# Altium schematic sheet Питание.SchDoc
size 209 x 297 mm; Scale: 1:1; DocumentType: Схема электрическая принципиальная; FirstReferrence: АБВГ.123456.001
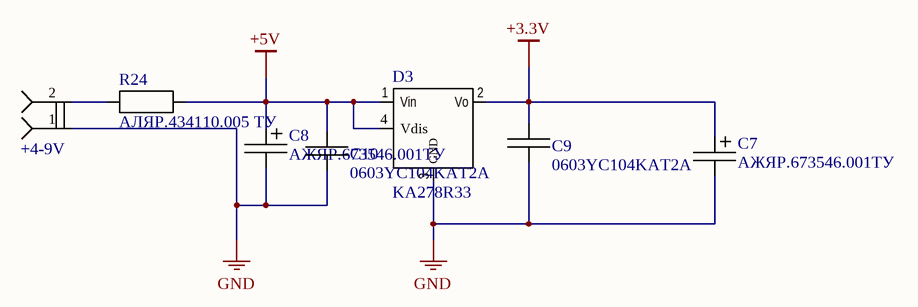
[diagram p0: Питание.SchDoc]

## Parts
+4-9V  (no value)  [284392-2_TE]
C7  АЖЯР.673546.001ТУ  [К53-56_ТИП5]
C8  АЖЯР.673546.001ТУ  [К53-56_ТИП5]
C9  0603YC104KAT2A  [0603-AVX]
C10  0603YC104KAT2A  [0603-AVX]
D3  KA278R33  [TO220-F-4L]
R24  АЛЯР.434110.005 ТУ  [Р1-12-0,25]

## Nets
+3.3V: C7.1 C9.2 D3.2(Vo)
+5V: C8.1 C10.2 D3.1(Vin) D3.4(Vdis) R24.2
GND: +4-9V.1 C7.2 C8.2 C9.1 C10.1 D3.3(GND)
Net+4-9V_2: +4-9V.2 R24.1

## Notes on the sheet
- Перв. примен.
- Справ. №
- Подп. и дата
- Инв. № дубл.
- Взам. инв. №
- Разраб.
- Изм.
- Лист
- № докум.
- Подп.
- Дата
- Лит.
- Масса
- Масштаб
- Пров.
- Т.контр.
- Листов
- Инв. № подл.
- Утв.
- Н.контр.
- 2.106-A4
- Копировал
- Формат А4

## Library data of the parts
+4-9V = Клемник 3.81х2 TE: Manufacturer: Tyco Electronics; ManufacturerPartNumber: 284392-2; Category: Соединитель
C7 C8 = ОСМ К53-56А-16В-100: ManufacturerPartNumber: ОСМ К53-56А-16В-100 мкФ ±10% -АЖЯР.673546.001ТУ П0.070.052; PartNumber1: П0.070.052; Power/Voltage: 16В; Tolerance: ±10%; Value: 100 мкФ; ESR: 1,5 Ом; Category: Конденсатор; PartNumber: АЖЯР.673546.001ТУ
C9 C10 = 0603-X7R-0,1мкФ-16В-10%: Manufacturer: AVX; TKE: X7R; Power/Voltage: 16 В; Tolerance: ±10%; Value: 0,1 мкФ; Category: Конденсатор; ManufacturerPartNumber: 0603YC104KAT2A; PartNumber: 0603YC104KAT2A
D3 = KA278R33: ManufacturerPartNumber: LM317MQDCYR; Category: Микросхема; PartNumber: KA278R33
R24 = Р1-12-0,25-0,75 Ом±5%: ManufacturerPartNumber: Р1-12-0,25-0,75 Ом±5%-У; Value: fuse 0.5A; Tolerance: ±5%; Power/Voltage: 0,25; Category: Резистор; PartNumber: АЛЯР.434110.005 ТУ